# Altium schematic sheet Connectors.SchDoc: Connectors
size A4; Date: 27.09.2023; ApprovedBy: M.Sc. Tobias Wirth; CheckedBy: M.Sc. Tobias Wirth; Author: M.Sc. Tobias Wirth; CompanyName: University of Stuttgart; DrawnBy: M.Sc. Tobias Wirth; Engineer: M.Sc. Tobias Wirth; Organization: IIS; Address1: Pfaffenwaldring 47; Address2: 70569 Stuttgart; Revision: V1.4; SheetNumber: 2; SheetTotal: 17; ProjectNameAlt: AUS - NMR System; Time: 14:10; ImagePath: N/A; Application_BuildNumber: N/A
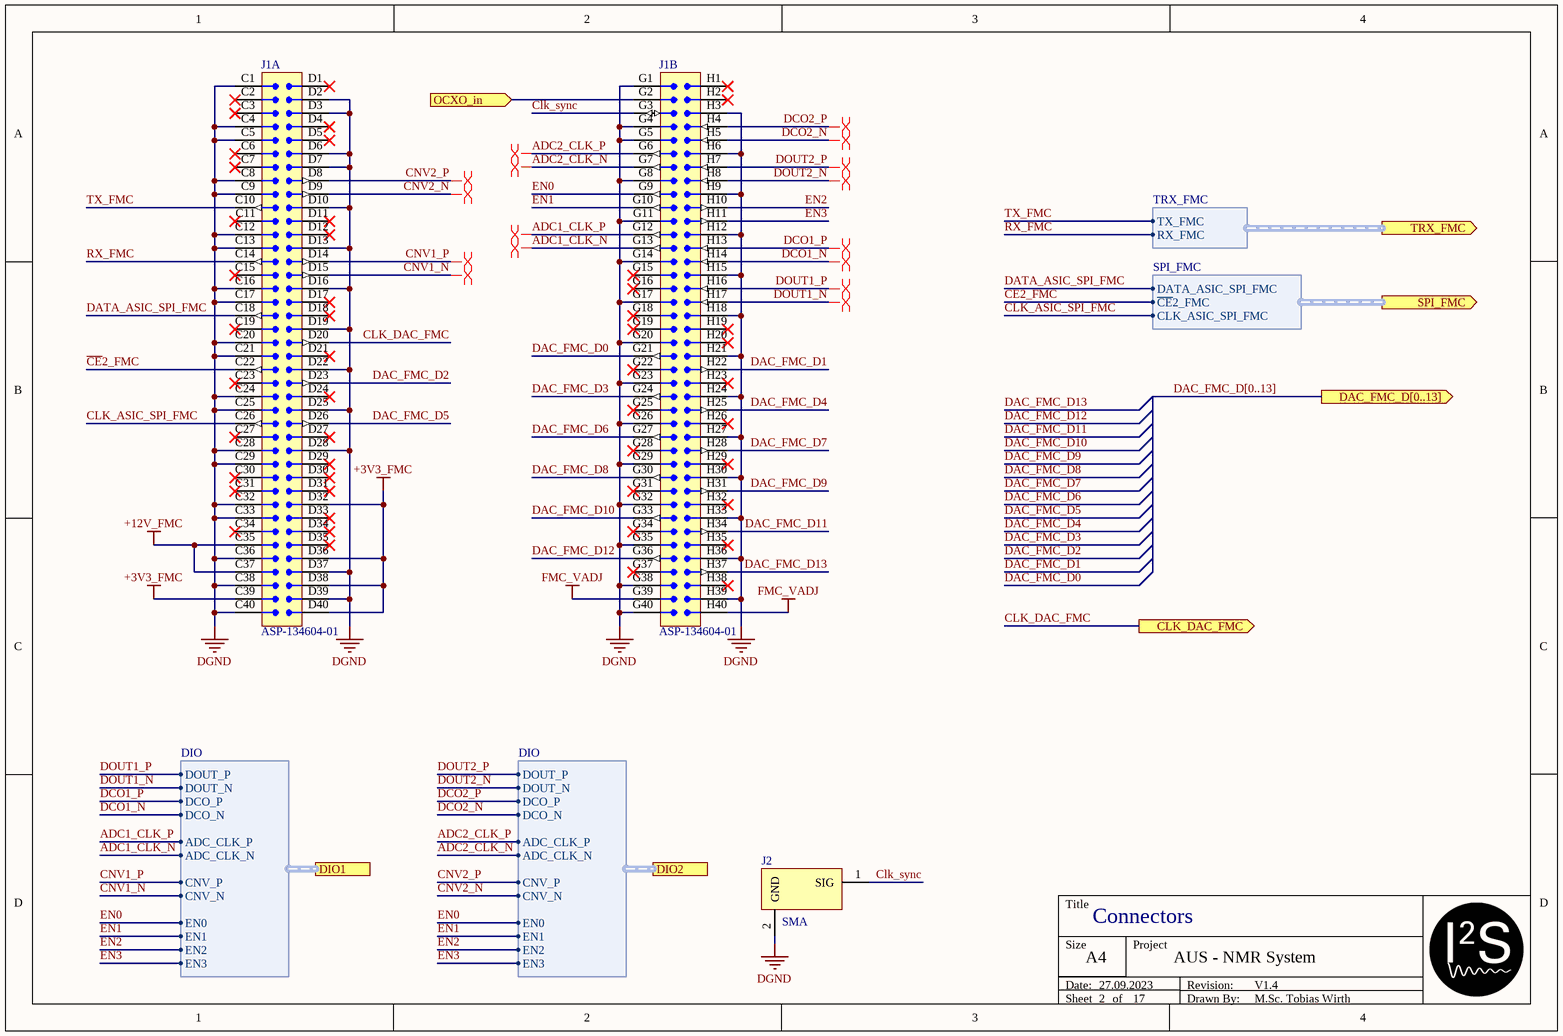
[diagram p0: Connectors.SchDoc]

## Parts
J1  ASP-134604-01  [ASP13460401]  (parts A,B of 2)
J2  SMA  [SMA]

## Ports
CLK_DAC_FMC (out), DAC_FMC_D[0..13] (out), DIO1 (harness DIO), DIO2 (harness DIO), OCXO_in (in), SPI_FMC (out, harness SPI_FMC), TRX_FMC (out, harness TRX_FMC)

## Harnesses
DIO: ADC_CLK_N, ADC_CLK_P, CNV_N, CNV_P, DCO_N, DCO_P, DOUT_N, DOUT_P, EN0, EN1, EN2, EN3
SPI_FMC: DATA_ASIC_SPI_FMC, ~{CE}2_FMC, CLK_ASIC_SPI_FMC
TRX_FMC: TX_FMC, RX_FMC

## Nets
+3V3_FMC: J1.C39 J1.D32 J1.D36 J1.D38 J1.D40
+12V_FMC: J1.C35 J1.C37
DGND: J1.C1 J1.C4 J1.C5 J1.C8 J1.C9 J1.C12 J1.C13 J1.C16 J1.C17 J1.C20 J1.C21 J1.C24 J1.C25 J1.C28 J1.C29 J1.C32 J1.C33 J1.C36 J1.C38 J1.C40 J1.D2 J1.D3 J1.D6 J1.D7 J1.D10 J1.D13 J1.D16 J1.D19 J1.D22 J1.D25 J1.D28 J1.D37 J1.D39 J1.G1 J1.G4 J1.G5 J1.G8 J1.G11 J1.G14 J1.G17 J1.G20 J1.G23 J1.G26 J1.G29 J1.G32 J1.G35 J1.G38 J1.G40 J1.H3 J1.H6 J1.H9 J1.H12 J1.H15 J1.H18 J1.H21 J1.H24 J1.H27 J1.H30 J1.H33 J1.H36 J1.H39 J2.2(GND)
FMC_VADJ: J1.G39 J1.H40
ADC1_CLK_N: J1.G13 ; port DIO1.ADC_CLK_N
ADC1_CLK_P: J1.G12 ; port DIO1.ADC_CLK_P
ADC2_CLK_N: J1.G7 ; port DIO2.ADC_CLK_N
ADC2_CLK_P: J1.G6 ; port DIO2.ADC_CLK_P
~{CE}2_FMC: J1.C22 ; port SPI_FMC.~{CE}2_FMC
CLK_ASIC_SPI_FMC: J1.C26 ; port SPI_FMC.CLK_ASIC_SPI_FMC
CLK_DAC_FMC: J1.D20 ; port CLK_DAC_FMC
Clk_sync: J1.G3 J2.1(SIG)
CNV1_N: J1.D15 ; port DIO1.CNV_N
CNV1_P: J1.D14 ; port DIO1.CNV_P
CNV2_N: J1.D9 ; port DIO2.CNV_N
CNV2_P: J1.D8 ; port DIO2.CNV_P
DAC_FMC_D0: J1.G21
DAC_FMC_D1: J1.H22
DAC_FMC_D2: J1.D23
DAC_FMC_D3: J1.G24
DAC_FMC_D4: J1.H25
DAC_FMC_D5: J1.D26
DAC_FMC_D6: J1.G27
DAC_FMC_D7: J1.H28
DAC_FMC_D8: J1.G30
DAC_FMC_D9: J1.H31
DAC_FMC_D10: J1.G33
DAC_FMC_D11: J1.H34
DAC_FMC_D12: J1.G36
DAC_FMC_D13: J1.H37
DATA_ASIC_SPI_FMC: J1.C18 ; port SPI_FMC.DATA_ASIC_SPI_FMC
DCO1_N: J1.H14 ; port DIO1.DCO_N
DCO1_P: J1.H13 ; port DIO1.DCO_P
DCO2_N: J1.H5 ; port DIO2.DCO_N
DCO2_P: J1.H4 ; port DIO2.DCO_P
DOUT1_N: J1.H17 ; port DIO1.DOUT_N
DOUT1_P: J1.H16 ; port DIO1.DOUT_P
DOUT2_N: J1.H8 ; port DIO2.DOUT_N
DOUT2_P: J1.H7 ; port DIO2.DOUT_P
EN0: J1.G9 ; port DIO1.EN0, port DIO2.EN0
EN1: J1.G10 ; port DIO1.EN1, port DIO2.EN1
EN2: J1.H10 ; port DIO1.EN2, port DIO2.EN2
EN3: J1.H11 ; port DIO1.EN3, port DIO2.EN3
OCXO_in: J1.G2 ; port OCXO_in
RX_FMC: J1.C14 ; port TRX_FMC.RX_FMC
TX_FMC: J1.C10 ; port TRX_FMC.TX_FMC

Not connected (* = marked no-connect by the designer): J1 C2* C3* C6* C7* C11* C15* C19* C23* C27* C30* C31* C34* D1* D4* D5* D11* D12* D17* D18* D21* D24* D27* D29* D30* D31* D33* D34* D35* G15* G16* G18* G19* G22* G25* G28* G31* G34* G37* H1* H2* H19* H20* H23* H26* H29* H32* H35* H38*

## Buses and harness runs
bus DAC_FMC_D[0..13] = port DAC_FMC_D[0..13]

## Layout directives
differential pair: ADC1_CLK_N, ADC1_CLK_P, ADC2_CLK_N, ADC2_CLK_P, CNV1_N, CNV1_P, CNV2_N, CNV2_P, DCO1_N, DCO1_P, DCO2_N, DCO2_P, DOUT1_N, DOUT1_P, DOUT2_N, DOUT2_P

## Notes on the sheet
- Title
- Size
- Date:
- Sheet
- A4
- of
- Project
- Drawn By:
- Revision:

## Library data of the parts
J1 = ASP-134604-01: Board to Board & Mezzanine Connectors "ASP"; Supplier 1: Arrow Electronics; Supplier Part Number 1: ASP-134604-01